# EAGLE design IoTSchem (EAGLE 9.6.2)
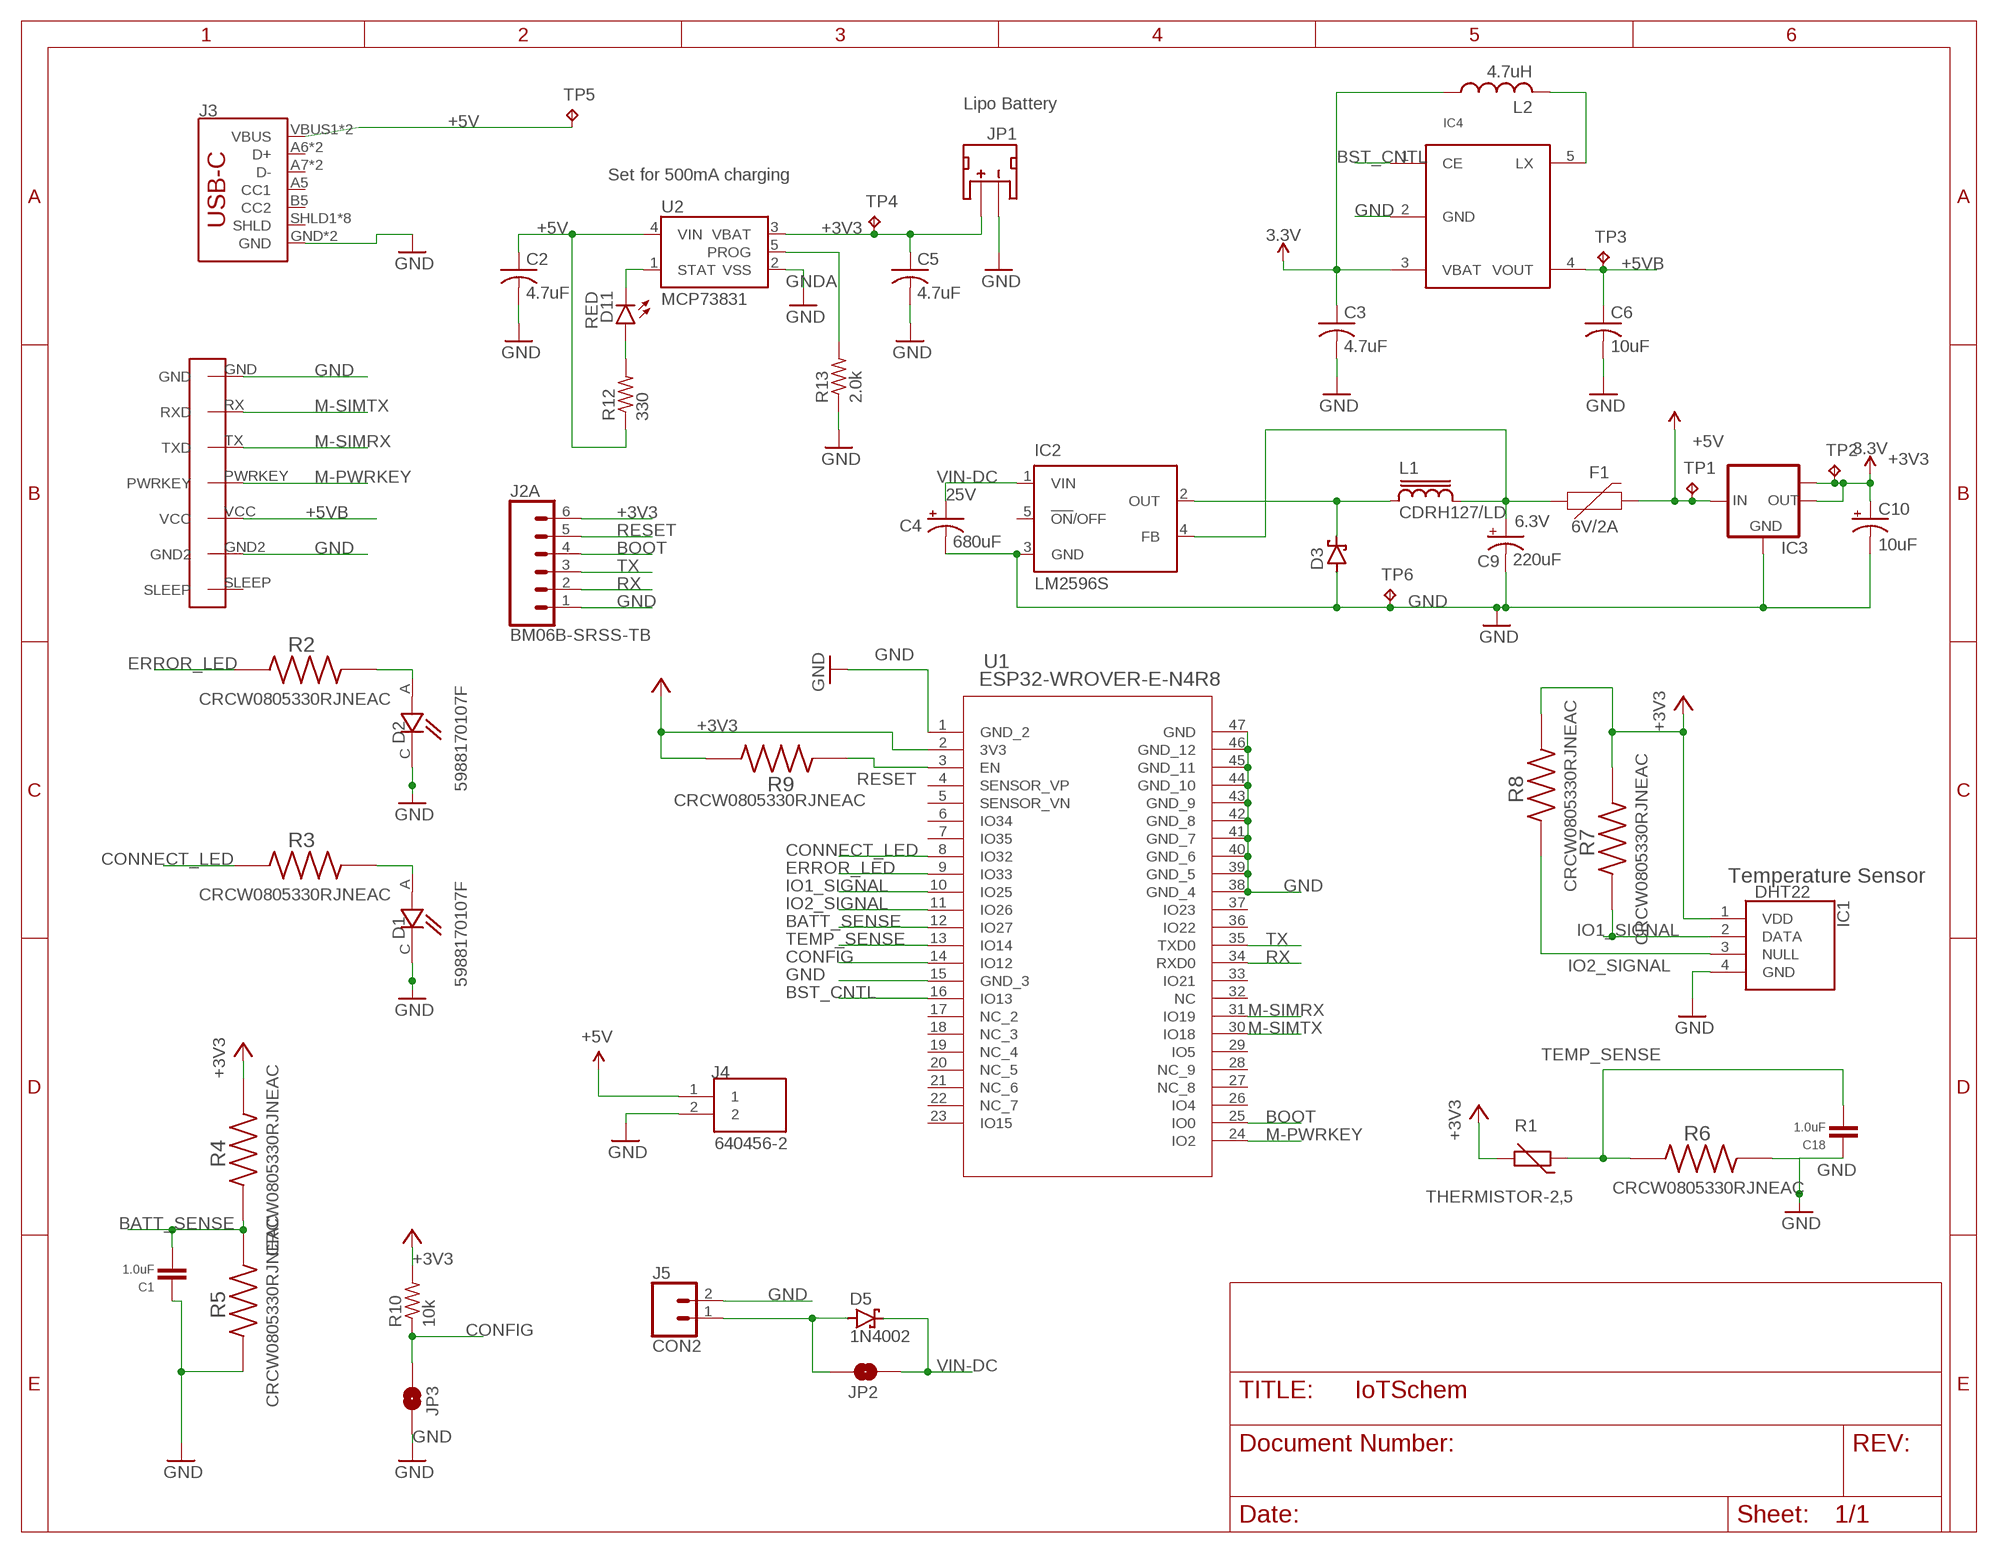
[diagram p0: schematic, sheet 1]

## Parts
C1  1.0uF  1.0UF-0805-25V-(+80/-20%)  [0805]
C2  4.7uF  C-USC0603  [C0603]
C3  4.7uF  C-USC0805  [C0805]
C4  680uF  CPOL-USE5-10.5  [E5-10,5]
C5  4.7uF  C-USC0603  [C0603]
C6  10uF  C-USC0805  [C0805]
C9  220uF  CPOL-USUD-6,3X5,8  [UD-6,3X5,8_NICHICON]
C10  10uF  10UF-POLAR-EIA3216-16V-10%(TANT)  [EIA3216]
C18  1.0uF  1.0UF-0805-25V-(+80/-20%)  [0805]
D1  5988170107F  [LEDC2012X70N]
D2  5988170107F  [LEDC2012X70N]
D3  SCHOTTKY-DIODESMD  [SMB]
D5  1N4002  SCHOTTKY-DIODESMD  [SMB]
D11  RED  LED-RED0603  [LED-0603]
F1  6V/2A  PPTC_6V2A  [1210]
IC1  DHT22  [DHT22]
IC2  LM2596S  [TO263-5]
IC3  LM1117MPX-3.3  [SOT223]
IC4  XC9140  [SOT-25]
J1  SIM7000A  [SIM7000A]
J2  BM06B-SRSS-TB  JST_6_PIN_HORIZONTAL  [JST-6-SMD-HORI-1.0MM]
J3  USB_C2-LAYER  [USB-C-16P]
J4  640456-2  [TE_640456-2]
J5  CON2  CONN_02  [1X02]
JP1  JST  JST_2MM_MALE  [JST-2-SMD]
JP2  JUMPER-SMT_2_NO_SILK  [SMT-JUMPER_2_NO_SILK]
JP3  JUMPER-SMT_2_NO_SILK  [SMT-JUMPER_2_NO_SILK]
L1  CDRH127/LD  [CDRH127/LD]
L2  4.7uH  L-USL2825P  [L2825P]
R1  THERMISTOR-2,5  [RS-2,5]
R2  CRCW0805330RJNEAC  [RESC2012X60N]
R3  CRCW0805330RJNEAC  [RESC2012X60N]
R4  CRCW0805330RJNEAC  [RESC2012X60N]
R5  CRCW0805330RJNEAC  [RESC2012X60N]
R6  CRCW0805330RJNEAC  [RESC2012X60N]
R7  CRCW0805330RJNEAC  [RESC2012X60N]
R8  CRCW0805330RJNEAC  [RESC2012X60N]
R9  CRCW0805330RJNEAC  [RESC2012X60N]
R10  10k  R-US_R0603  [R0603]
R12  330  R-US_R0603  [R0603]
R13  2.0k  R-US_R0603  [R0603]
TP1  TPB1,27  [B1,27]
TP2  TPB1,27  [B1,27]
TP3  TPB1,27  [B1,27]
TP4  TPB1,27  [B1,27]
TP5  TPB1,27  [B1,27]
TP6  TPB1,27  [B1,27]
U1  ESP32-WROVER-E-N4R8  [ESP32­WROVER­E/ESP32­WROVER­IE]
U2  MCP73831  [SOT23-5]

## Nets
3.3V: C3.1 IC4.3(VBAT) L2.1
+3V3 [5V Power]: C5.1 C10.+ IC1.1(VDD) IC3.2(OUT) IC3.TAB(OUT1) J2.6 JP1.2(+) R1.2 R4.2 R7.2 R8.2 R9.2 R10.2 TP2.TP TP4.TP U1.2(3V3) U2.3(VBAT) ; supply symbol labelled 3.3V
+5V [5V Power]: C2.1 F1.2 IC3.3(IN) J3.VBUS1(VBUS) J3.VBUS2(VBUS) J4.1 R12.1 TP1.TP TP5.TP U2.4(VIN) ; supply symbol labelled 5V
+5VB [5V Power]: C6.1 IC4.4(VOUT) J1.VCC TP3.TP
BATT_SENSE: C1.2 R4.1 R5.2 U1.12(IO27)
BOOT: J2.4 U1.25(IO0)
BST_CNTL: IC4.1(CE) U1.16(IO13)
CONFIG: JP3.2 R10.1 U1.14(IO12)
CONNECT_LED: R3.1 U1.8(IO32)
ERROR_LED: R2.1 U1.9(IO33)
GND: C1.1 C2.2 C3.2 C4.- C5.2 C6.2 C9.- C10.- C18.1 D1.C D2.C D3.A IC1.4(GND) IC2.3(GND) IC3.1(GND) IC4.2(GND) J1.GND J1.GND2 J2.1 J3.GND J3.GND2(GND) J4.2 J5.2 JP1.1(-) JP3.1 R5.1 R6.2 R13.1 TP6.TP U1.1(GND_2) U1.15(GND_3) U1.38(GND_4) U1.39(GND_5) U1.40(GND_6) U1.41(GND_7) U1.42(GND_8) U1.43(GND_9) U1.44(GND_10) U1.45(GND_11) U1.46(GND_12) U1.47(GND)
GNDA: U2.2(VSS) ; supply symbol labelled GND
IO1_SIGNAL: IC1.2(DATA) R7.1 U1.10(IO25)
IO2_SIGNAL: IC1.3(NULL) R8.1 U1.11(IO26)
M-PWRKEY: J1.PWRKEY U1.24(IO2)
M-SIMRX: J1.TX(TXD) U1.31(IO19)
M-SIMTX: J1.RX(RXD) U1.30(IO18)
N$1: D5.A J5.1 JP2.1
N$3: D11.A R12.2
N$4: IC4.5(LX) L2.2
N$5: D1.A R3.2
N$6: D2.A R2.2
N$9: C9.+ F1.1 IC2.4(FB) L1.2
OUT [ADC]: D3.C IC2.2(OUT) L1.1
PROG: R13.2 U2.5(PROG)
RESET: J2.5 R9.1 U1.3(EN)
RX: J2.2 U1.34(RXD0)
STAT: D11.C U2.1(STAT)
TEMP_SENSE [LOGIC]: C18.2 R1.1 R6.1 U1.13(IO14)
TX: J2.3 U1.35(TXD0)
VIN-DC: C4.+ D5.C IC2.1(VIN) JP2.2
Unconnected: IC2.5(!ON!/OFF) J1.SLEEP J2.M1 J2.M2 J3.A5(CC1) J3.A6(D+) J3.A7(D-) J3.B5(CC2) J3.B6(D+) J3.B7(D-) J3.SHLD1(SHLD) J3.SHLD2(SHLD) J3.SHLD3(SHLD) J3.SHLD4(SHLD) J3.SHLD5(SHLD) J3.SHLD6(SHLD) J3.SHLD7(SHLD) J3.SHLD8(SHLD) JP1.NC1(PAD1) JP1.NC2(PAD2) U1.4(SENSOR_VP) U1.5(SENSOR_VN) U1.6(IO34) U1.7(IO35) U1.17(NC_2) U1.18(NC_3) U1.19(NC_4) U1.20(NC_5) U1.21(NC_6) U1.22(NC_7) U1.23(IO15) U1.26(IO4) U1.27(NC_8) U1.28(NC_9) U1.29(IO5) U1.32(NC) U1.33(IO21) U1.36(IO22) U1.37(IO23)

## Notes on the sheet
- Lipo Battery
- Set for 500mA charging
- Temperature Sensor

## Library data of the parts
C1 C18 = SparkFun-Capacitors:1.0UF: 1µF ceramic capacitors A capacitor is a passive two-terminal electrical component used to store electrical energy temporarily in an electric field.; PROD_ID: CAP-11625
C2 C3 C5 C6 = rcl:C-US: CAPACITOR, American symbol; SPICEPREFIX: C
C4 = rcl:CPOL-US: POLARIZED CAPACITOR, American symbol; VOLTAGE: 25V
C9 = rcl:CPOL-US: POLARIZED CAPACITOR, American symbol; VOLTAGE: 6.3V
C10 = SparkFun-Capacitors:10UF-POLAR: 10.0µF polarized capacitors A capacitor is a passive two-terminal electrical component used to store electrical energy temporarily in an electric field.; PROD_ID: CAP-00811
D1 D2 = 5988170107F:5988170107F: Standard LEDs - SMD Green Water Clr 40mcd 570nm; DESCRIPTION: Green 566nm LED Indication - Discrete 2V 0805 (2012 Metric); DIGI-KEY_PART_NUMBER: 350-2044-1-ND; MF: Dialight; MP: 5988170107F; PACKAGE: 0805 Dialight; PURCHASE-URL: https://pricing.snapeda.com/search/part/5988170107F/?ref=eda
D3 D5 = diode:SCHOTTKY-DIODE: Schottky Diode
D11 = SparkFun-LED:LED-RED: Red SMD LED Used in manufacturing of most products at SparkFun Packages: 0603 - SMD 0603 package [Product Link] <http://docs.avagotech.com/docs/AV02-0551EN> 0603 SMART - SMD 0603 SMART package ( more efficient and expensive)[Product Link] <http://www.osram-os.com/Graphics/XPic2/00077099_0.pdf> 1206 - SMD1206 package [Product Link] <https://www.sparkfun.com/datasheets/DevTools/LilyPad/Q150OVS4.pdff> SparkFun Products: Pro Mini 328 -5V <https://www.sparkfun.com/products/821> RedBoard <https://www.sparkfun.com/products/12757> IOIO-OTG <https://www.sparkfun.com/products/13613>; PROD_ID: DIO-00819
F1 = SparkFun-Fuses:PPTC: Resettable Fuse PPTC Resettable Fuse. Really a sort of resistor with a polymeric positive temperature coefficient whose resistance increases dramatically with an increase in temperature. When heated by the power passing through the resistance rises causing the current to be limited, protecting the circuit. This is achieved by the transition of the polymer from a crystalline to an amorphous state where the conductive carbon separates breaking the conductive pathways found in the cool crystalline structure. When a PPTC cools back down it resumes conducting letting the circuit turn back on. SparkFun Products: SparkFun RedBoard - Programmed with Arduino <https://www.sparkfun.com/products/12757> Pro Micro - 5V/16MHz <https://www.sparkfun.com/products/12640> Arduino Pro 328 - 5V/16MHz <https://www.sparkfun.com/products/10915> MP3 Trigger <https://www.sparkfun.com/products/13720>; PROD_ID: RES-14313
IC1 = DHT22:DHT22: Digital-output relative humidity & temperature sensor/module DHT22 Source: Datasheet <https://datasheet4u.com/datasheet-parts/DHT22-datasheet.php?id=792211>; DESCRIPTION: Digital-output relative humidity & temperature sensor/module DHT22; HEIGHT: 25.1mm; MANUFACTURER_NAME: Aosong Electronics; MANUFACTURER_PART_NUMBER: DHT22
IC2 = national-semiconductor:LM2596: SIMPLE SWITCHER® Power Converter 150 kHz 3A Step-Down Voltage Regulator Source: http://www.national.com/ds/LM/LM2596.pdf; MF: NATIONAL SEMICONDUCTOR; MPN: LM2596S-ADJ/NOPB; OC_FARNELL: 9494367; OC_NEWARK: 41K3842
IC3 = lm1117:LM1117MPX-*
IC4 = MyLIb:XC9140
J1 = SoftwareLogisticsParts:SIM7000A
J2 = SparkFun-Connectors:JST_6_PIN_HORIZONTAL: JST 6 pin horizontal connector JST-SH type. Here is the connector we sell at SparkFun: name <link> (XXX-00000) Datasheet <http://www.sparkfun.com/datasheets/GPS/EM406-SMDConnector-eSH.pdf> It was used on these SparkFun products: name <link> (XXX-00000) name <link> (XXX-00000); PROD_ID: XXX-00000
J3 = SparkFun-Connectors:USB_C: USB Type C 16Pin Connector Super Speed pins not available on the 16-pin purely SMD connector so this part is best for USB 2.0 implementations. D1 and D2 are tied together enabling D+/- no matter which way the cable is plugged into the connector. The two channel configuration pins (CC1/2) are exposed. These are normally connected to ground via 5.1k resistors but can be reconfigured for high current/high power applications.; PROD_ID: CONN-14122
J4 = 640456-2:640456-2: 220P MTA100 HDR ASSY SQ SPCL; COMMENT: 640456-2; DESCRIPTION: Connector Header Through Hole 2 position 0.100 (2.54mm); DIGI-KEY_PART_NUMBER: A1921-ND; EU_ROHS_COMPLIANCE: Compliant; MF: TE Connectivity; MP: 640456-2; PACKAGE: None; PURCHASE-URL: https://pricing.snapeda.com/search/part/640456-2/?ref=eda
J5 = SparkFun-Connectors:CONN_02: Multi connection point. Often used as Generic Header-pin footprint for 0.1 inch spaced/style header connections On any of the 0.1 inch spaced packages, you can populate with these: Break Away Headers - Straight <https://www.sparkfun.com/products/116> (PRT-00116) Break Away Male Headers - Right Angle <https://www.sparkfun.com/products/553> (PRT-00553) Female Headers <https://www.sparkfun.com/products/115> (PRT-00115) Break Away Headers - Machine Pin <https://www.sparkfun.com/products/117> (PRT-00117) Break Away Female Headers - Swiss Machine Pin <https://www.sparkfun.com/products/743> (PRT-00743) For SCREWTERMINALS and SPRING TERMINALS visit here: Screw Terimnals on SparkFun.com <https://www.sparkfun.com/search/results?term=Screw+Terminals> (5mm/3.5mm/2.54mm spacing) This device is also useful as a general connection point to wire up your design to another part of your project. Our various solder wires solder well into these plated through hole pads. Hook-Up Wire - Assortment (Stranded, 22 AWG) <https://www.sparkfun.com/products/11375> (PRT-11375) Hook-Up Wire - Assortment (Solid Core, 22 AWG) <https://www.sparkfun.com/products/11367> (PRT-11367) View the entire wire category on our website here <https://www.sparkfun.com/categories/141> Special notes: Molex polarized connector foot print use with: PRT-08233 with associated crimp pins and housings. 2.54_SCREWTERM for use with PRT-10571. 3.5mm Screw Terminal footprints for PRT-08084 5mm Screw Terminal footprints for use with PRT-08432
JP1 = SparkFun-Connectors:JST_2MM_MALE: JST 2MM MALE RA CONNECTOR Two pin, compact surface mount connector. Commonly used as a battery input connection point. We really like the solid locking feeling and high current rating on these small connectors. We use these all the time as battery connectors. Mates to single-cell LiPo batteries. Here is the connector we sell at SparkFun: JST Right Angle Connector - White <https://www.sparkfun.com/products/8612> (PRT-08612) Datasheet <http://www.sparkfun.com/datasheets/Prototyping/Connectors/JST-Horizontal.pdf> It was used on these SparkFun products: SparkFun MOSFET Power Controller <https://www.sparkfun.com/products/11214> (PRT-11214) SparkFun Battery Babysitter - LiPo Battery Manager <https://www.sparkfun.com/products/13777> (PRT-13777) And many, many others that required a lipo battery connection.; PROD_ID: CONN-11443; SF_ID: PRT-08612
JP2 JP3 = SparkFun-Jumpers:JUMPER-SMT_2_NO: Normally open jumper This jumper has two pads in close proximity to each other. Apply solder to close the connection. Round pads are easier to solder for beginners, but are a lot larger. SparkFun Product that uses the round pads: SparkFun EL Sequencer <https://www.sparkfun.com/products/12781>
L1 = inductor-sumida:CDRH127/LD: Power Inductor
L2 = rcl:L-US: INDUCTOR, American symbol; SPICEPREFIX: L
R1 = varistor:THERMISTOR: THERMISTOR
R2-R9 = CRCW0805330RJNEAC:CRCW0805330RJNEAC; DESCRIPTION: 330 Ohms ±5% 0.125W, 1/8W Chip Resistor 0805 (2012 Metric) - Thick Film; DIGI-KEY_PART_NUMBER: 541-4168-1-ND; MF: Vishay; MP: CRCW0805330RJNEAC; PACKAGE: 2012 Vishay; PURCHASE-URL: https://pricing.snapeda.com/search/part/CRCW0805330RJNEAC/?ref=eda
R10 R12 R13 = rcl:R-US_: RESISTOR, American symbol; SPICEPREFIX: R
TP1-TP6 = testpad:TP: Test pad
U1 = ESP32WROVER:ESP32-WROVER-E-N4R8; COPYRIGHT: Copyright (C) 2022 Ultra Librarian. All rights reserved.; DIGI-KEY_PART_NUMBER_1: 1965-ESP32-WROVER-E-N4R8TR-ND; DIGI-KEY_PART_NUMBER_2: 1965-ESP32-WROVER-E-N4R8CT-ND; DIGI-KEY_PART_NUMBER_3: 1965-ESP32-WROVER-E-N4R8DKR-ND; MANUFACTURER_PART_NUMBER: ESP32-WROVER-E-N4R8; MFR_NAME: Espressif Systems
U2 = SparkFun-PowerIC:MCP73831: Miniature single cell, fully integrated Li-Ion, Li-polymer charge management controller http://ww1.microchip.com/downloads/en/DeviceDoc/21984a.pdf IC-09995; PROD_ID: IC-09995

## Net classes
0 default: width 0.356 mm, drill 0.508 mm, clearance 0.305 mm
1 5V Power: width 0.457 mm, drill 0.508 mm, clearance 0.305 mm
3 LOGIC: width 0.356 mm, drill 0.508 mm, clearance 0.305 mm
4 ADC: width 0.356 mm, drill 0.508 mm, clearance 0.305 mm

## Board
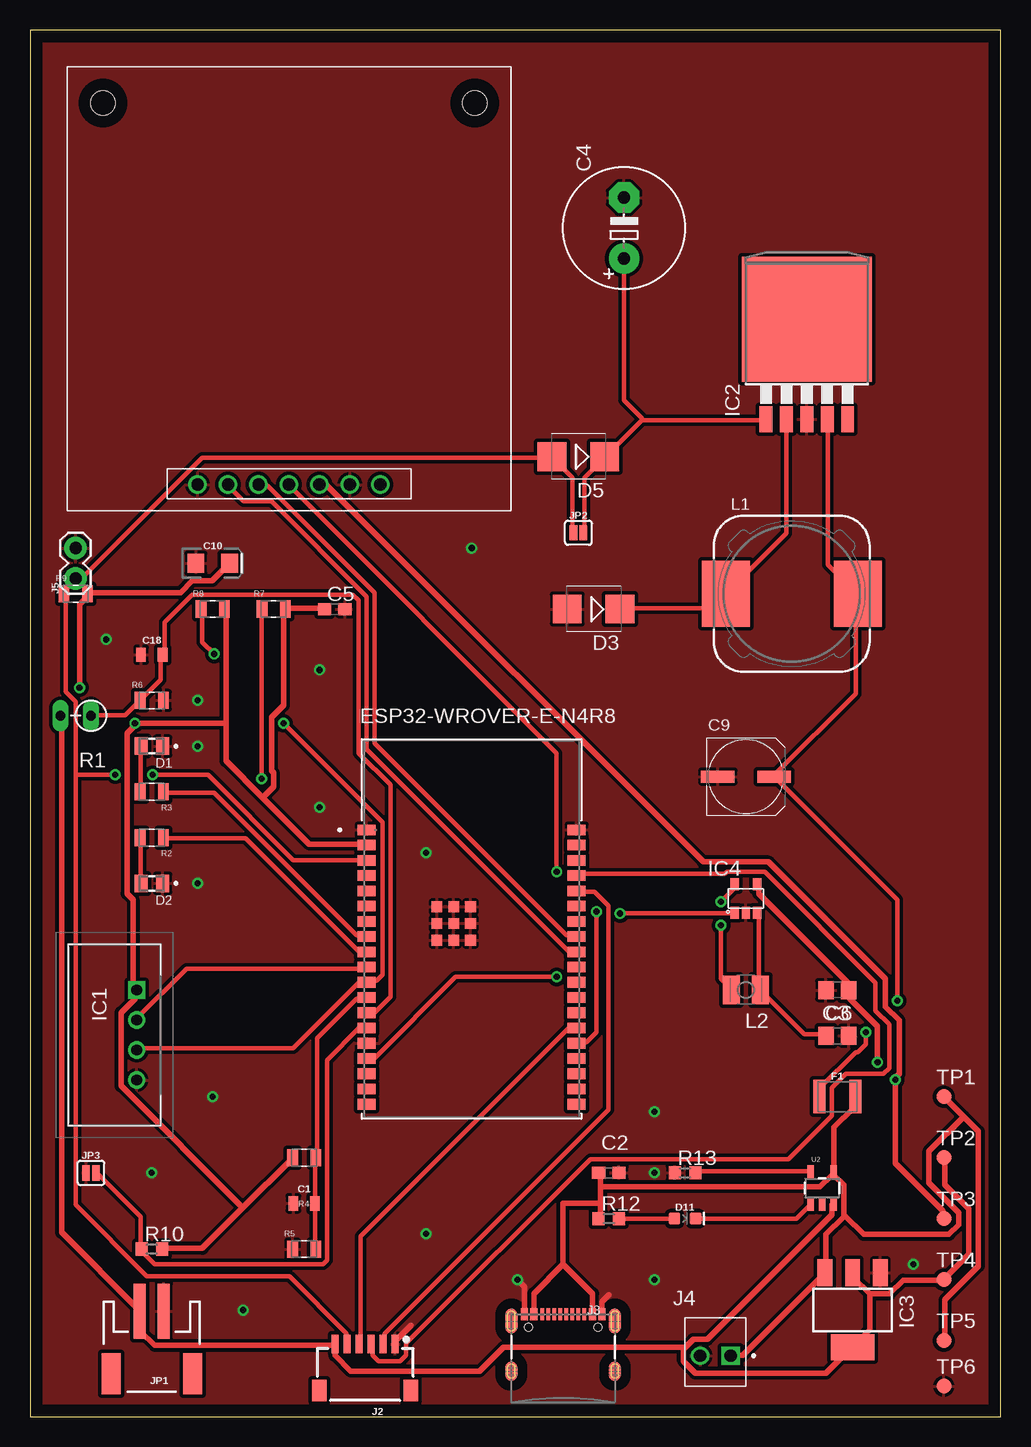
[diagram p1: board, top side]
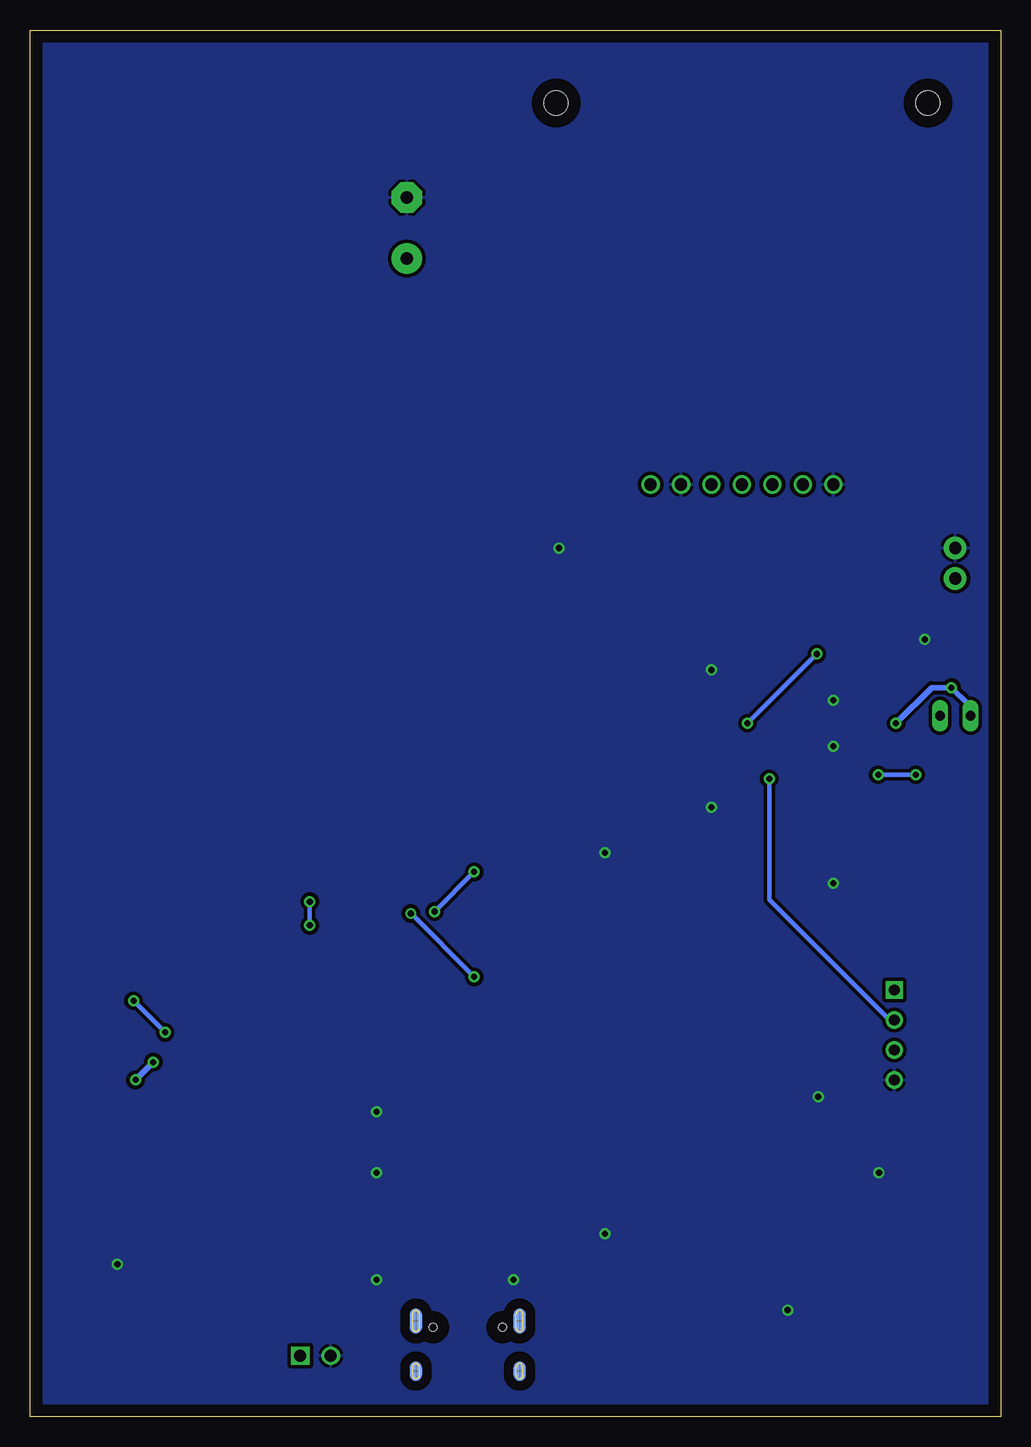
[diagram p2: board, bottom side, seen from below]

Size 80.95 x 115.56 mm. Coordinates in mm from the lower left corner, seen from the top.
Outline: 0,0 80.95,0 80.95,115.56 0,115.56 0,0
Copper layers (1*16): Top 0.035mm / dielectric 1.5mm / Bottom 0.035mm
Design rules "default": minimum track width 6mil, minimum drill 0.35mm, track to track 6mil, track to pad 6mil, pad to pad 6mil, via to via 6mil, smd to smd 6mil, copper to edge 40mil, drill to drill 6mil, minimum pad ring 10mil, minimum via ring 8mil, stop-mask expansion 4mil, vias tented up to drill 0mil, thermal gap 10mil

### Footprints (pad centres in the part's own frame; a part is rotated, then mirrored left to right if it is on the bottom)
0805 = smd 0.8 x 1.2: 1 -0.9,0; 2 0.9,0
C0603 = smd 1.1 x 1: 1 -0.85,0; 2 0.85,0
C0805 = smd 1.3 x 1.5: 1 -0.95,0; 2 0.95,0
E5-10,5 = drill 1.016 pad 2.54: + -2.54,0 | drill 1.016 pad 2.54 octagon: - 2.54,0
UD-6,3X5,8_NICHICON = smd 2.8 x 1: + 2.35,0; - -2.35,0
EIA3216 = smd 1.4 x 1.6: + 1.4,0; - -1.4,0
LEDC2012X70N = smd 1.1 x 1.45: A 0.9,0; C -0.9,0
SMB = smd 2.4 x 2.4: A 2.2,0; C -2.2,0
LED-0603 = smd 1 x 1: A -0.877,0; C 0.877,0
1210 = smd 1 x 2.8: 1 -1.5,0; 2 1.5,0
DHT22 = drill 0.91 pad 1.416 square: 1 0,0 | drill 0.91 pad 1.416: 2 2.5,0; 3 5,0; 4 7.5,0
TO263-5 = smd 1.067 x 2.159: 1 -3.404,-5.791; 2 -1.702,-5.791; 3 0,-5.791; 4 1.702,-5.791; 5 3.404,-5.791 | smd 10.8 x 10.41: 6 0,2.54
SOT223 = smd 1.219 x 2.235: 1 -2.311,-3.099; 2 0,-3.099; 3 2.311,-3.099 | smd 3.6 x 2.2: TAB 0,3.099
SOT-25 = smd 0.7 x 1: 1 -0.95,-1.2; 2 0,-1.2; 3 0.95,-1.2; 4 0.95,1.2; 5 -0.95,1.2
SIM7000A = drill 1.016: GND -16.3,7.62; GND2 -16.3,-5.08; PWRKEY -16.3,0; RX -16.3,5.08; SLEEP -16.3,-7.62; TX -16.3,2.54; VCC -16.3,-2.54 | hole 2: 15.5,-15.5; 15.5,15.5
JST-6-SMD-HORI-1.0MM = smd 0.6 x 1.55: 1 -2.5,-4.775; 2 -1.5,-4.775; 3 -0.5,-4.775; 4 0.5,-4.775; 5 1.5,-4.775; 6 2.5,-4.775 | smd 1.2 x 1.8: M1 -3.8,-0.9; M2 3.8,-0.9
USB-C-16P = smd 0.3 x 1: A5 -1.25,-0.34; A6 -0.25,-0.34; A7 0.25,-0.34; A8 1.25,-0.34; B5 1.75,-0.34; B6 0.75,-0.34; B7 -0.75,-0.34; B8 -1.75,-0.34 | smd 0.6 x 1: GND -3.225,-0.34; GND2 3.225,-0.34; VBUS1 -2.45,-0.34; VBUS2 2.45,-0.34 | smd 1 x 2.1: SHLD1 -4.32,-0.915; SHLD2 4.32,-0.915 | smd 1 x 2.1 bottom: SHLD3 -4.32,-0.915; SHLD4 4.32,-0.915 | smd 1 x 1.6: SHLD5 -4.32,-5.095; SHLD8 4.32,-5.095 | smd 1 x 1.6 bottom: SHLD6 -4.32,-5.095; SHLD7 4.32,-5.095 | hole 0.65: -2.89,-1.445; 2.89,-1.445
TE_640456-2 = drill 1.02 pad 1.37 square: 1 0,0 | drill 1.02 pad 1.37: 2 -2.54,0
1X02 = drill 1.016 pad 1.88: 1 0,0; 2 2.54,0
JST-2-SMD = smd 1 x 4.6: 1 -1,-3.7; 2 1,-3.7 | smd 1.6 x 3.4: NC1 -3.4,1.5; NC2 3.4,1.5
SMT-JUMPER_2_NO_SILK = smd 0.635 x 1.27: 1 -0.406,0; 2 0.406,0
CDRH127/LD = smd 4 x 5.5: 1 -5.5,0; 2 5.5,0
L2825P = smd 1.4 x 2.4: 1 -1.2,0; 2 1.2,0
RS-2,5 = drill 0.813 long: 1 -1.27,0; 2 1.27,0
RESC2012X60N = smd 0.89 x 1.42: 1 -0.97,0; 2 0.97,0
R0603 = smd 1 x 1.1: 1 -0.85,0; 2 0.85,0
B1,27 = smd 1.27 x 1.27: TP 0,0
ESP32­WROVER­E/ESP32­WROVER­IE = smd 1.499 x 0.889: 1 -8.75,8.26; 2 -8.75,6.99; 3 -8.75,5.72; 4 -8.75,4.45; 5 -8.75,3.18; 6 -8.75,1.91; 7 -8.75,0.64; 8 -8.75,-0.63; 9 -8.75,-1.9; 10 -8.75,-3.17; 11 -8.75,-4.44; 12 -8.75,-5.71; 13 -8.75,-6.98; 14 -8.75,-8.25; 15 -8.75,-9.52; 16 -8.75,-10.79; 17 -8.75,-12.06; 18 -8.75,-13.33; 19 -8.75,-14.6; 20 8.75,-14.6; 21 8.75,-13.33; 22 8.75,-12.06; 23 8.75,-10.79; 24 8.75,-9.52; 25 8.75,-8.25; 26 8.75,-6.98; 27 8.75,-5.71; 28 8.75,-4.44; 29 8.75,-3.17; 30 8.75,-1.9; 31 8.75,-0.63; 32 8.75,0.64; 33 8.75,1.91; 34 8.75,3.18; 35 8.75,4.45; 36 8.75,5.72; 37 8.75,6.99; 38 8.75,8.26 | smd 0.889 x 0.889: 39 -2.903,1.862; 40 -1.504,1.862; 41 -0.104,1.862; 42 -2.903,0.462; 43 -1.504,0.462; 44 -0.104,0.462; 45 -2.903,-0.937; 46 -1.504,-0.937; 47 -0.104,-0.937
SOT23-5 = smd 0.55 x 1.2: 1 -0.95,-1.3; 2 0,-1.3; 3 0.95,-1.3; 4 0.95,1.3; 5 -0.95,1.3

### Placement (x,y rotation side)
C1  22.86,17.78 0 top
C2  48.26,20.32 0 top
C3  67.31,31.75 0 top
C4  49.53,99.06 90 top
C5  25.4,67.31 0 top
C6  67.31,35.56 180 top
C9  59.69,53.34 0 top
C10  15.24,71.12 0 top
C18  10.16,63.5 0 top
D1  10.16,55.88 180 top
D2  10.16,44.45 180 top
D3  46.99,67.31 180 top
D5  45.72,80.01 180 top
D11  54.61,16.51 0 top
F1  67.31,26.67 0 top
IC1  8.89,35.56 270 top
IC2  64.77,88.9 0 top
IC3  68.58,8.89 180 top
IC4  59.69,43.18 0 top
J1  21.59,93.98 90 top
J2  27.94,1.27 180 top
J3  44.45,8.89 0 top
J4  58.42,5.08 0 top
J5  3.81,69.85 90 top
JP1  10.16,5.08 180 top
JP2  45.72,73.66 0 top
JP3  5.08,20.32 0 top
L1  63.5,68.58 0 top
L2  59.69,35.56 180 top
R1  3.81,58.42 180 top
R2  10.16,48.26 180 top
R3  10.16,52.07 180 top
R4  22.86,21.59 180 top
R5  22.86,13.97 0 top
R6  10.16,59.69 0 top
R7  20.32,67.31 0 top
R8  15.24,67.31 0 top
R9  3.81,68.58 0 top
R10  10.16,13.97 0 top
R12  48.26,16.51 0 top
R13  54.61,20.32 0 top
TP1  76.2,26.67 0 top
TP2  76.2,21.59 0 top
TP3  76.2,16.51 0 top
TP4  76.2,11.43 0 top
TP5  76.2,6.35 0 top
TP6  76.2,2.54 0 top
U1  36.83,40.64 0 top
U2  66.04,19.05 0 top

### Tracks (layer width: path | path; a pad name or v marks a point on that pad's centre or on a via)
3.3V
  Top 0.356: IC4.3 60.76,41.94 60.76,35.66 L2.1 60.92,35.5 64.55,31.86 66.2,31.86 C3.1
+3V3  (via drill 0.51)
  Top 0.457: 17.75,17.42 21.79,21.46 R4.2 | 17.75,17.42 14.36,14.03 11.06,14.03 R10.2 | 17.75,17.42 7.59,27.57 7.59,33.68 8.75,34.84 8.75,35.5 IC1.1 8.59,35.66 8.59,43.09 8.09,43.59 8.09,56.96 8.75,57.62 v8.75,57.78 16.34,57.78 | C10.+ 16.51,70.99 15.19,69.67 13.54,69.67 12.55,68.68 4.79,68.68 R9.2 4.79,68.35 4.13,67.69 v4.13,60.76 | C5.1 24.43,67.36 21.3,67.36 R7.2 21.13,67.2 21.13,59.27 20.14,58.28 20.14,53.82 20.31,53.66 20.31,52.5 19.4,51.59 | 16.34,57.78 16.34,54.65 19.4,51.59 | 16.34,57.78 16.34,67.2 R8.2 | 19.4,51.59 23.28,47.71 28.07,47.71 U1.2 | 70,10.24 71.65,10.24 72.81,11.39 76.11,11.39 TP4.TP 76.28,11.56 78.26,13.54 78.26,17.34 76.28,19.32 76.28,21.46 TP2.TP | 70,10.24 68.68,11.56 68.68,11.89 IC3.2 | 54.57,5.7 54.48,5.61 54.48,4.62 55.47,3.63 66.37,3.63 68.52,5.78 IC3.TAB 68.68,5.94 70,7.26 70,10.24 | 54.57,5.7 55.31,6.44 56.46,6.44 66.86,16.84 66.86,17.67 U2.3 | 54.57,5.7 54.48,5.78 39.46,5.78 37.48,3.8 26.75,3.8 25.43,5.12 25.43,5.78 J2.6 25.43,5.94 10.4,5.94 9.25,7.1 9.25,8.75 JP1.2 9.08,8.91 2.64,15.35 2.64,58.28 R1.2
  Bottom 0.457: R1.2 2.64,58.45 2.64,59.27 v4.13,60.76 5.78,60.76 v8.75,57.78
+5V
  Top 0.457: 77.84,25.01 76.28,26.58 TP1.TP | 77.84,25.01 79.08,23.77 79.08,12.55 76.28,9.74 76.28,6.44 TP5.TP | 47.55,19.15 47.55,20.31 C2.1 | 47.55,19.15 47.55,17.78 | 47.55,17.78 47.55,16.51 R12.1 | U2.4 67.03,20.47 67.03,24.11 68.68,25.76 68.68,26.58 F1.2 | 67.86,16.68 66.37,15.19 66.37,12.05 IC3.3 66.2,11.89 59.44,5.12 58.45,5.12 J4.1 | 67.86,16.68 67.86,19.32 67.03,20.14 U2.4 | 47.55,19.15 65.88,19.15 66.86,20.14 U2.4 | 77.84,25.01 74.95,22.12 74.95,19.48 77.43,17 77.43,16.02 76.61,15.19 69.51,15.19 68.02,16.68 67.86,16.68 | J3.VBUS2 46.9,10.25 44.45,12.7 | 44.45,12.7 44.45,17.78 47.55,17.78 | J3.VBUS1 42,10.25 44.45,12.7
+5VB  (via drill 0.51)
  Top 0.457: IC4.4 60.76,44.25 60.76,43.59 68.19,36.16 68.19,35.66 C6.1 68.35,35.5 68.35,34.84 70.66,32.52 v70.66,29.55 | TP3.TP 76.11,16.51 76.11,17.17 72.15,21.13 v72.15,28.07 72.15,28.23 72.48,28.56 72.48,33.02 71.32,34.18 71.32,36.49 61.58,46.23 56.13,46.23 24.77,77.6 24.27,77.6 J1.VCC
  Bottom 0.457: v70.66,29.55 v72.15,28.07
BATT_SENSE
  Top 0.356: R5.2 23.77,14.03 23.77,17.67 C1.2 23.77,17.83 23.77,21.46 R4.1 23.94,21.63 23.94,31.53 27.24,34.84 28.07,34.84 U1.12
BOOT
  Top 0.356: U1.25 45.57,32.36 44.91,32.36 27.57,15.02 27.57,6.11 J2.4
BST_CNTL  (via drill 0.51)
  Top 0.356: v49.2,41.94 58.61,41.94 IC4.1 | v43.92,36.65 35.5,36.65 28.73,29.88 28.23,29.88 U1.16
  Bottom 0.356: v43.92,36.65 v49.2,41.94
CONFIG
  Top 0.356: JP3.2 5.61,20.31 9.25,16.68 9.25,14.03 R10.1 9.25,13.87 10.4,12.71 24.43,12.71 24.77,13.04 24.77,29.72 27.41,32.36 28.07,32.36 U1.14
CONNECT_LED
  Top 0.356: R3.1 11.23,52.01 15.35,52.01 27.24,40.12 28.07,40.12 U1.8
ERROR_LED
  Top 0.356: R2.1 11.23,48.21 18,48.21 27.41,38.8 28.07,38.8 U1.9
GND  (via drill 0.51)
  Top 0.457: J2.1 30.44,6.31 31.75,7.62 | J3.GND 41.23,10.85 v40.64,11.43 | J3.GND2 47.67,9.57 48.26,10.16
  other vias: 33.02,15.24 52.07,25.4 52.07,11.43 73.66,12.7 36.83,72.39 24.13,62.23 6.35,64.77 13.97,59.69 15.24,26.67 10.16,20.32 17.78,8.89 33.02,46.99 24.13,50.8 52.07,20.32 13.97,55.88 13.97,44.45
  pour Top: -1.27,116.84 -1.27,-1.27 107.95,-1.27 107.95,116.84
  pour Bottom: -1.27,116.84 82.55,116.84 82.55,-1.27 -1.27,-1.27
IO1_SIGNAL  (via drill 0.51)
  Top 0.356: v19.32,53.16 19.32,67.2 R7.1 | U1.10 28.07,37.31 13.04,37.31 8.91,33.19 IC1.2
  Bottom 0.356: v19.32,53.16 19.32,43.09 9.41,33.19 8.91,33.19 IC1.2
IO2_SIGNAL  (via drill 0.51)
  Top 0.356: v15.35,63.56 14.36,64.55 14.36,67.2 R8.1 | v21.13,57.78 29.39,49.53 29.39,36.82 28.89,36.32 28.23,36.32 U1.11 27.9,36.16 27.41,36.16 21.96,30.71 8.91,30.71 IC1.3
  Bottom 0.356: v21.13,57.78 v15.35,63.56
M-PWRKEY  (via drill 0.51)
  Top 0.356: v47.22,42.1 47.22,32.03 46.39,31.2 45.73,31.2 U1.24 | v43.92,45.4 43.92,55.31 21.63,77.6 J1.PWRKEY
  Bottom 0.356: v43.92,45.4 v47.22,42.1
M-SIMRX
  Top 0.356: U1.31 45.57,40.12 44.74,40.12 28.73,56.13 28.73,68.68 19.81,77.6 19.15,77.6 J1.TX
M-SIMTX
  Top 0.356: U1.30 45.57,38.8 44.91,38.8 28.07,55.64 28.07,68.35 20.14,76.28 17.83,76.28 16.51,77.6 J1.RX
N$1
  Top 0.356: JP2.1 45.24,73.8 45.24,78.26 43.59,79.91 D5.A 43.42,79.91 14.36,79.91 4.46,70 3.96,70 J5.1
N$3
  Top 0.356: R12.2 D11.A
N$4  (via drill 0.51)
  Top 0.356: v57.62,42.93 58.61,43.92 58.61,44.25 IC4.5 | v57.62,40.95 57.62,36.49 58.45,35.66 L2.2
  Bottom 0.356: v57.62,40.95 v57.62,42.93
N$5
  Top 0.356: R3.2 9.25,52.17 9.25,55.8 D1.A
N$6
  Top 0.356: R2.2 9.25,48.21 9.25,44.58 D2.A
N$9  (via drill 0.51)
  Top 0.356: IC2.4 66.53,83.05 66.53,70.99 68.85,68.68 L1.2 68.85,68.52 68.85,60.26 62.08,53.49 C9.+ 62.08,53.33 72.31,43.09 v72.31,34.67 | v69.67,32.03 69.67,31.04 69.01,30.38 68.85,30.38 65.88,27.41 65.88,26.75 F1.1
  Bottom 0.356: v72.31,34.67 v69.67,32.03
OUT
  Top 0.356: IC2.2 63.07,73.64 58.12,68.68 L1.1 57.95,68.52 56.79,67.36 49.2,67.36 D3.C
PROG
  Top 0.356: R13.2 55.47,20.47 65.05,20.47 U2.5
RESET  (via drill 0.51)
  Top 0.356: 3.8,53.49 3.8,17.67 9.74,11.72 21.63,11.72 26.42,6.93 26.42,6.11 J2.5 | 3.8,53.49 3.8,59.6 2.97,60.43 2.97,68.52 R9.1 | v10.24,53.49 14.86,53.49 21.96,46.39 28.07,46.39 U1.3 | 3.8,53.49 v7.1,53.49
  Bottom 0.356: v7.1,53.49 v10.24,53.49
RX
  Top 0.356: U1.34 45.73,43.75 47.05,43.75 48.21,42.6 48.21,25.59 29.55,6.93 29.55,6.11 J2.2
STAT
  Top 0.356: D11.C 63.89,16.51 65.05,17.67 U2.1
TEMP_SENSE
  Top 0.356: U1.13 28.23,33.68 28.73,33.68 30.05,35 30.05,52.67 27.41,55.31 27.41,68.02 26.91,68.52 13.54,68.52 11.23,66.2 11.23,63.56 C18.2 10.9,63.4 10.9,61.42 9.25,59.77 R6.1 9.08,59.6 7.92,58.45 5.12,58.45 R1.1
TX
  Top 0.356: U1.35 45.73,45.24 57.95,45.24 58.12,45.4 61.25,45.4 70.5,36.16 70.5,33.85 71.65,32.69 71.65,29.06 71.16,28.56 68.02,28.56 66.86,27.41 66.86,25.09 63.23,21.46 46.72,21.46 31.37,6.11 31.37,5.12 30.87,4.62 29.06,4.62 28.56,5.12 28.56,5.94 J2.3
VIN-DC
  Top 0.356: JP2.2 46.23,73.8 46.23,78.26 47.88,79.91 D5.C 48.04,80.07 51.02,83.05 | 51.02,83.05 61.25,83.05 IC2.1 | C4.+ 49.53,84.7 51.02,83.21 51.02,83.05